# Altium schematic sheet S7CAS-PLEIADES-CARTE-MERE_P01_FPGA-BANK1.SchDoc
size Tabloid; DocumentNumber: 12; SheetNumber: 12; SheetTotal: 17; Sheet_Name: FPGA - BANK 1; Size: 11x17
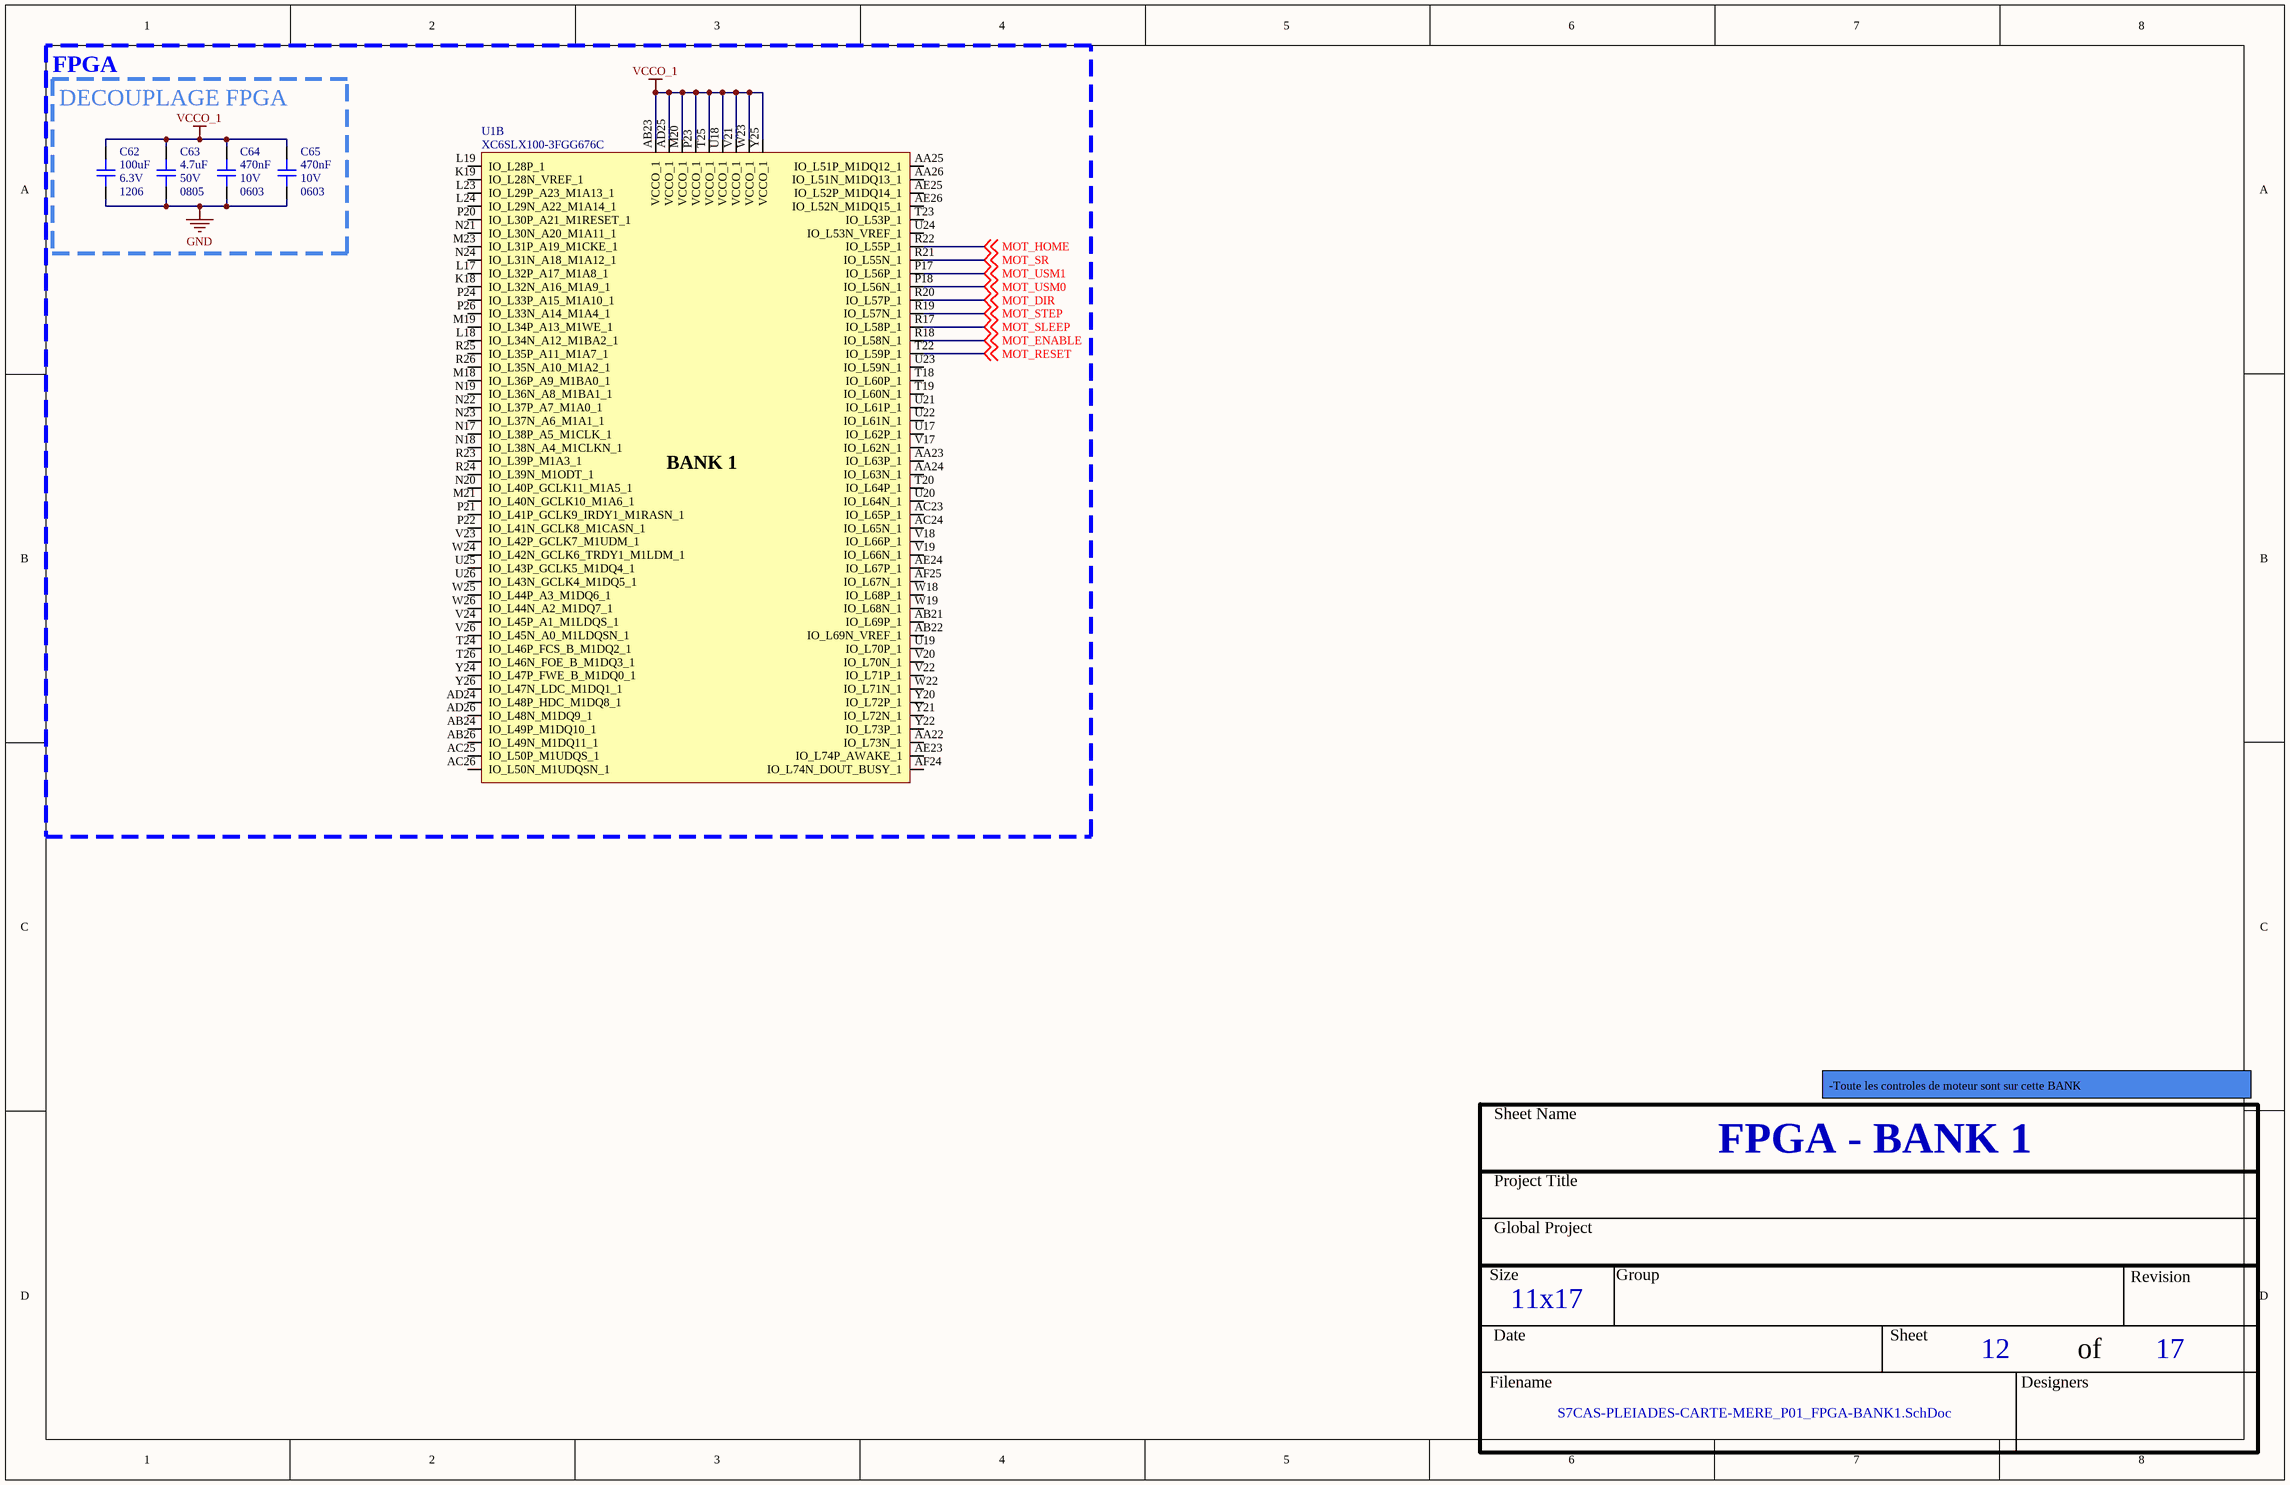
[diagram p0: S7CAS-PLEIADES-CARTE-MERE_P01_FPGA-BANK1.SchDoc]

## Parts
C62  value 100uF  Voltage: 6.3V  Package: 1206  [CAP_1206]  (hidden comment: CAP - 1206)
C63  value 4.7uF  Voltage: 50V  Package: 0805  [CAP_0805]  (hidden comment: CAP - 0805)
C64  value 470nF  Voltage: 10V  Package: 0603  [CAP_0603]  (hidden comment: CAP - 0603)
C65  value 470nF  Voltage: 10V  Package: 0603  [CAP_0603]  (hidden comment: CAP - 0603)
U1  XC6SLX100-3FGG676C  [FPGA_XILINX_FGG676]  (part B of 10)

## Nets
GND: C62.1 C63.1 C64.1 C65.1
VCCO_1: C62.2 C63.2 C64.2 C65.2 U1.AB23(VCCO_1) U1.AD25(VCCO_1) U1.M20(VCCO_1) U1.P23(VCCO_1) U1.T25(VCCO_1) U1.U18(VCCO_1) U1.V21(VCCO_1) U1.W23(VCCO_1) U1.Y25(VCCO_1)
MOT_DIR: U1.R20(IO_L57P_1) ; off-sheet MOT_DIR
MOT_ENABLE: U1.R18(IO_L58N_1) ; off-sheet MOT_ENABLE
MOT_HOME: U1.R22(IO_L55P_1) ; off-sheet MOT_HOME
MOT_RESET: U1.T22(IO_L59P_1) ; off-sheet MOT_RESET
MOT_SLEEP: U1.R17(IO_L58P_1) ; off-sheet MOT_SLEEP
MOT_SR: U1.R21(IO_L55N_1) ; off-sheet MOT_SR
MOT_STEP: U1.R19(IO_L57N_1) ; off-sheet MOT_STEP
MOT_USM0: U1.P18(IO_L56N_1) ; off-sheet MOT_USM0
MOT_USM1: U1.P17(IO_L56P_1) ; off-sheet MOT_USM1

Not connected (* = marked no-connect by the designer): U1 AA22(IO_L73N_1) AA23(IO_L63P_1) AA24(IO_L63N_1) AA25(IO_L51P_M1DQ12_1) AA26(IO_L51N_M1DQ13_1) AB21(IO_L69P_1) AB22(IO_L69N_VREF_1) AB24(IO_L49P_M1DQ10_1) AB26(IO_L49N_M1DQ11_1) AC23(IO_L65P_1) AC24(IO_L65N_1) AC25(IO_L50P_M1UDQS_1) AC26(IO_L50N_M1UDQSN_1) AD24(IO_L48P_HDC_M1DQ8_1) AD26(IO_L48N_M1DQ9_1) AE23(IO_L74P_AWAKE_1) AE24(IO_L67P_1) AE25(IO_L52P_M1DQ14_1) AE26(IO_L52N_M1DQ15_1) AF24(IO_L74N_DOUT_BUSY_1) AF25(IO_L67N_1) K18(IO_L32N_A16_M1A9_1) K19(IO_L28N_VREF_1) L17(IO_L32P_A17_M1A8_1) L18(IO_L34N_A12_M1BA2_1) L19(IO_L28P_1) L23(IO_L29P_A23_M1A13_1) L24(IO_L29N_A22_M1A14_1) M18(IO_L36P_A9_M1BA0_1) M19(IO_L34P_A13_M1WE_1) M21(IO_L40N_GCLK10_M1A6_1) M23(IO_L31P_A19_M1CKE_1) N17(IO_L38P_A5_M1CLK_1) N18(IO_L38N_A4_M1CLKN_1) N19(IO_L36N_A8_M1BA1_1) N20(IO_L40P_GCLK11_M1A5_1) N21(IO_L30N_A20_M1A11_1) N22(IO_L37P_A7_M1A0_1) N23(IO_L37N_A6_M1A1_1) N24(IO_L31N_A18_M1A12_1) P20(IO_L30P_A21_M1RESET_1) P21(IO_L41P_GCLK9_IRDY1_M1RASN_1) P22(IO_L41N_GCLK8_M1CASN_1) P24(IO_L33P_A15_M1A10_1) P26(IO_L33N_A14_M1A4_1) R23(IO_L39P_M1A3_1) R24(IO_L39N_M1ODT_1) R25(IO_L35P_A11_M1A7_1) R26(IO_L35N_A10_M1A2_1) T18(IO_L60P_1) T19(IO_L60N_1) T20(IO_L64P_1) T23(IO_L53P_1) T24(IO_L46P_FCS_B_M1DQ2_1) T26(IO_L46N_FOE_B_M1DQ3_1) U17(IO_L62P_1) U19(IO_L70P_1) U20(IO_L64N_1) U21(IO_L61P_1) U22(IO_L61N_1) U23(IO_L59N_1) U24(IO_L53N_VREF_1) U25(IO_L43P_GCLK5_M1DQ4_1) U26(IO_L43N_GCLK4_M1DQ5_1) V17(IO_L62N_1) V18(IO_L66P_1) V19(IO_L66N_1) V20(IO_L70N_1) V22(IO_L71P_1) V23(IO_L42P_GCLK7_M1UDM_1) V24(IO_L45P_A1_M1LDQS_1) V26(IO_L45N_A0_M1LDQSN_1) W18(IO_L68P_1) W19(IO_L68N_1) W22(IO_L71N_1) W24(IO_L42N_GCLK6_TRDY1_M1LDM_1) W25(IO_L44P_A3_M1DQ6_1) W26(IO_L44N_A2_M1DQ7_1) Y20(IO_L72P_1) Y21(IO_L72N_1) Y22(IO_L73P_1) Y24(IO_L47P_FWE_B_M1DQ0_1) Y26(IO_L47N_LDC_M1DQ1_1)

## Notes on the sheet
- FPGA
- DECOUPLAGE FPGA
- -Toute les controles de moteur sont sur cette BANK
- Sheet Name
- Project Title
- Global Project
- Size
- Group
- Revision
- Date
- Sheet
- of
- Filename
- Designers
- (in symbol FPGA_XC6SLX100-3FGG676C, part B) BANK 1

## Library data of the parts
C62 = CAP - 1206: 100 µF ±20% 6.3V Ceramic Capacitor X6T 1206 (3216 Metric); Mfg Part Number: GRM31CD80J107MEA8K; Mfg: Murata Electronics; Current: *; CreatedBy: Jonathan Bouchard; Power: *; Precision: 20%
C63 = CAP - 0805: 4.7 µF ±10% 50V Ceramic Capacitor X5R 0805 (2012 Metric); Mfg Part Number: GRT21BR61H475KE13L; Mfg: Murata Electronics; Current: *; CreatedBy: Jonathan Bouchard; Power: *; Precision: 10%
C64 C65 = CAP - 0603: Mfg Part Number: C0603X474K8RAC; Precision: 10%; Current: *; CreatedBy: Jonathan Bouchard; Power: *
U1 = FPGA_XC6SLX100-3FGG676C: FPGA - XILINX SPARTAN 6 480 I/O - BGA-676; Voltage: 1.14 V ~ 1.26 V; Current: *; Power: *; Mfg: Xilinx; Mfg Part Number: XC6SLX100-3FGG676C; HelpURL: https://www.xilinx.com/support/documentation/data_sheets/ds162.pdf; CreatedBy: Jonathan Bouchard; Temperature: 0°C ~ 85°C (TJ); Value: *; Precision: *; Package: BGA-676; Supplier 1: Digikey; Supplier Part Number 1: 122-1760-ND; Part Number #1: XC6SLX100-3FGG676C